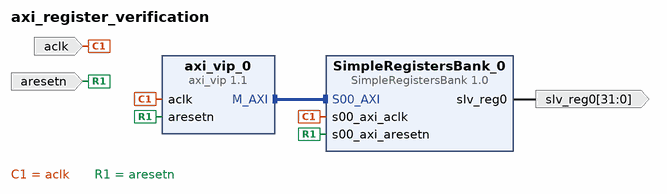
[diagram p0: block diagram of the top level]
# Vivado block design axi_register_verification, xcvu065-ffvc1517-1-i, Vivado 2025.1
create_bd_design axi_register_verification

create_bd_port -dir I -type clk aclk
set_property -dict {CONFIG.FREQ_HZ 100000000} [get_bd_ports aclk]
create_bd_port -dir I -type rst aresetn
create_bd_port -dir O -from 31 -to 0 slv_reg0

create_bd_cell -type ip -vlnv xilinx.com:ip:axi_vip:1.1 axi_vip_0
set_property -dict [list \
  CONFIG.ADDR_WIDTH 32 \
  CONFIG.DATA_WIDTH 32 \
  CONFIG.HAS_BRESP 1 \
  CONFIG.HAS_PROT 1 \
  CONFIG.HAS_RRESP 1 \
  CONFIG.HAS_WSTRB 1 \
  CONFIG.INTERFACE_MODE MASTER \
  CONFIG.PROTOCOL AXI4LITE \
  CONFIG.READ_WRITE_MODE READ_WRITE \
] [get_bd_cells axi_vip_0]
create_bd_cell -type ip -vlnv user.org:user:SimpleRegistersBank:1.0 SimpleRegistersBank_0

# ---- connections ----

connect_bd_intf_net [get_bd_intf_pins axi_vip_0/M_AXI] [get_bd_intf_pins SimpleRegistersBank_0/S00_AXI]
connect_bd_net [get_bd_pins SimpleRegistersBank_0/slv_reg0] [get_bd_ports slv_reg0]
connect_bd_net [get_bd_ports aclk] [get_bd_pins axi_vip_0/aclk] [get_bd_pins SimpleRegistersBank_0/s00_axi_aclk]
connect_bd_net [get_bd_ports aresetn] [get_bd_pins axi_vip_0/aresetn] [get_bd_pins SimpleRegistersBank_0/s00_axi_aresetn]

# ---- address map ----
assign_bd_address -offset 0x44A00000 -range 64K -target_address_space [get_bd_addr_spaces axi_vip_0/Master_AXI] [get_bd_addr_segs SimpleRegistersBank_0/S00_AXI/S00_AXI_reg]

validate_bd_design
save_bd_design
